# Altium schematic sheet Measure.SchDoc: AC POWER METER
size 420 x 297 mm; DrawnBy: Truong Giang; DocumentNumber: Learning; SheetNumber: 5; SheetTotal: 6
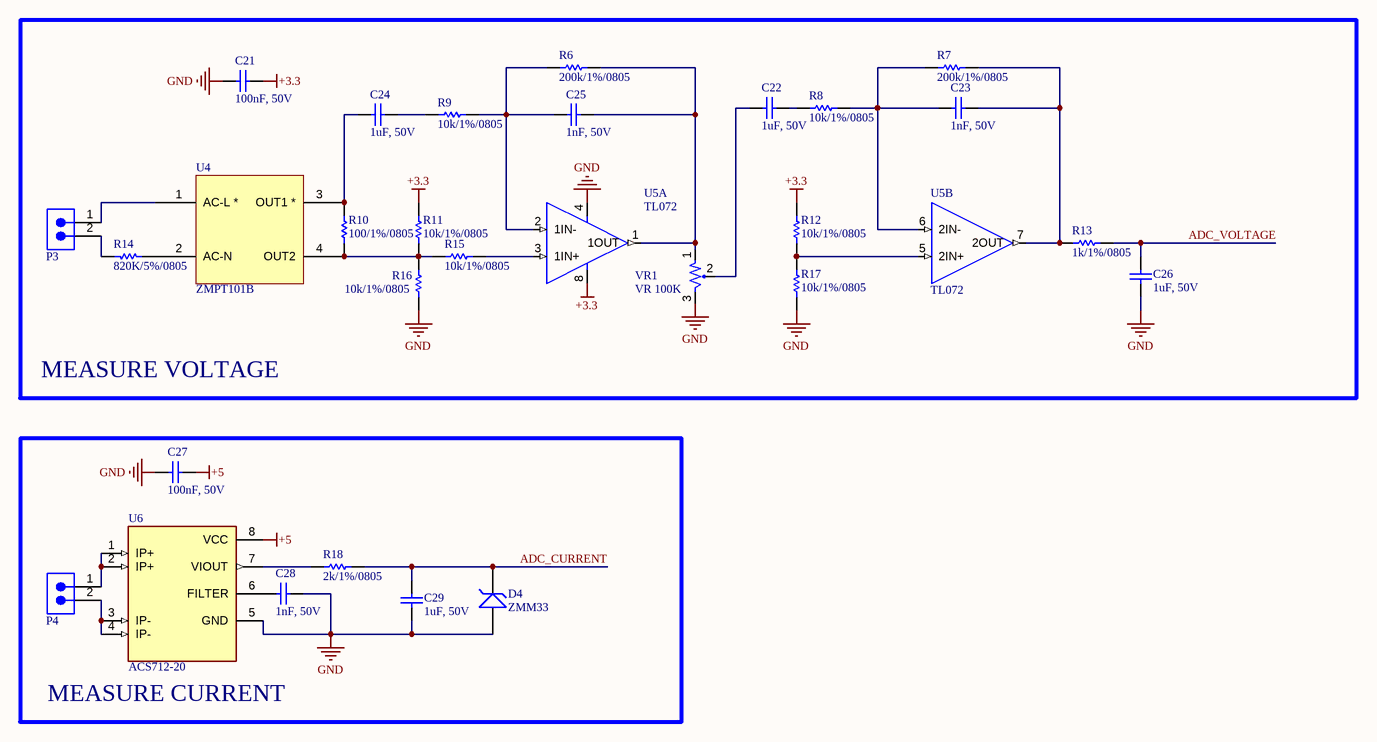
[diagram p0: Measure.SchDoc]

## Parts
C21  100nF, 50V  [WCAP-CSGP_0805_H=0.8mm_Wave]
C22  1uF, 50V  [WCAP-CSGP_0805_H=1.25mm]
C23  1nF, 50V  [WCAP-CSGP_0805_H=0.8mm_Wave]
C24  1uF, 50V  [WCAP-CSGP_0805_H=1.25mm]
C25  1nF, 50V  [WCAP-CSGP_0805_H=0.8mm_Wave]
C26  1uF, 50V  [WCAP-CSGP_0805_H=1.25mm]
C27  100nF, 50V  [WCAP-CSGP_0805_H=0.8mm_Wave]
C28  1nF, 50V  [WCAP-CSGP_0805_H=0.8mm_Wave]
C29  1uF, 50V  [WCAP-CSGP_0805_H=1.25mm]
D4  ZMM33  [SOD-80]
P3  691312710002  [691312710002]  (value not drawn)
P4  691312710002  [691312710002]  (value not drawn)
R6  value 200k/1%/0805  [RES-SM-0805]  (hidden comment: RESISTOR SMD)
R7  value 200k/1%/0805  [RES-SM-0805]  (hidden comment: RESISTOR SMD)
R8  value 10k/1%/0805  [RES-SM-0805]  (hidden comment: RESISTOR SMD)
R9  value 10k/1%/0805  [RES-SM-0805]  (hidden comment: RESISTOR SMD)
R10  value 100/1%/0805  [RES-SM-0805]  (hidden comment: RESISTOR SMD)
R11  value 10k/1%/0805  [RES-SM-0805]  (hidden comment: RESISTOR SMD)
R12  value 10k/1%/0805  [RES-SM-0805]  (hidden comment: RESISTOR SMD)
R13  value 1k/1%/0805  [RES-SM-0805]  (hidden comment: RESISTOR SMD)
R14  value 820K/5%/0805  [RES-SM-0805]  (hidden comment: RESISTOR SMD)
R15  value 10k/1%/0805  [RES-SM-0805]  (hidden comment: RESISTOR SMD)
R16  value 10k/1%/0805  [RES-SM-0805]  (hidden comment: RESISTOR SMD)
R17  value 10k/1%/0805  [RES-SM-0805]  (hidden comment: RESISTOR SMD)
R18  value 2k/1%/0805  [RES-SM-0805]  (hidden comment: RESISTOR SMD)
U4  ZMPT101B  [ZMPT101B]
U5  TL072  [DIP794W45P254L1060H508Q8]  (parts A,B of 2)
U6  ACS712-20  [SOIC127P600X175-8N]
VR1  value VR 100K  [VARISTOR 2]  (hidden comment: 10K)

## Blocks framed on the sheet
MEASURE VOLTAGE: C21-C26 P3 R6-R17 U4 U5 VR1
MEASURE CURRENT: C27-C29 D4 P4 R18 U6

## Nets
+3.3: C21.2 R11.1 R12.1 U5.8(VCC+)
+5: C27.2 U6.8(VCC)
GND: C21.1 C26.1 C27.1 C28.2 C29.1 D4.1(A) R16.1 R17.1 U5.4(VCC-) U6.5(GND) VR1.3
ADC_CURRENT: C29.2 D4.2(K) R18.2
ADC_VOLTAGE: C26.2 R13.2
NetC22_1: C22.1 R8.1
NetC22_2: C22.2 VR1.2
NetC23_1: C23.1 R7.2 R13.1 U5.7(2OUT)
NetC23_2: C23.2 R7.1 R8.2 U5.6(2IN-)
NetC24_1: C24.1 R10.1 U4.3(OUT1_*)
NetC24_2: C24.2 R9.1
NetC25_1: C25.1 R6.1 R9.2 U5.2(1IN-)
NetC25_2: C25.2 R6.2 U5.1(1OUT) VR1.1
NetC28_1: C28.1 U6.6(FILTER)
NetP3_1: P3.1 U4.1(AC-L_*)
NetP3_2: P3.2 R14.2
NetP4_1: P4.1 U6.1(IP+) U6.2(IP+)
NetP4_2: P4.2 U6.3(IP-) U6.4(IP-)
NetR10_2: R10.2 R11.2 R15.1 R16.2 U4.4(OUT2)
NetR12_2: R12.2 R17.2 U5.5(2IN+)
NetR14_1: R14.1 U4.2(AC-N)
NetR15_2: R15.2 U5.3(1IN+)
NetR18_1: R18.1 U6.7(VIOUT)

## Notes on the sheet
- PROJECT
- TITLE
- DRAWN BY
- SIZE
- FILE NAME
- SHEET
- OF
- A3

## Library data of the parts
C21 C27 = 885012207098: WCAP-CSGP Multilayer Ceramic Chip Capacitor, General Purpose, size 0805, X7R, 100nF, 50V; Manufacturer: Wurth Elektronik; Rated Voltage: 50VDC; Isolation Resistance: >=5GOhm; Capacitance Tolerance: +/-10%; Technical Reference: X7R0805104K050DFCT10000; ComponentLink1Description: Manufacturer; ComponentLink1URL: http://www.we-online.de; ComponentLink2Description: Datasheet; ComponentLink2URL: https://www.we-online.com/catalog/datasheet/885012207098.pdf; Operating Temperature: -55 to +125degC; Packaging: Tape and Reel; Manufacturer Part Number: 885012207098; Published Date: May 2020; Ceramic Type: X7R; Dissipation Factor: =<2.5%; Height: 0.8mm; Mounting Technology: SMT; Size: 0805; Capacitance: 100nF
C22 C24 C26 C29 = 885012207103: WCAP-CSGP Multilayer Ceramic Chip Capacitor, General Purpose, size 0805, X7R, 1uF, 50V; Manufacturer: Wurth Elektronik; Rated Voltage: 50VDC; Isolation Resistance: >=0.1GOhm; Capacitance Tolerance: +/-10%; Technical Reference: X7R0805105K050DFCT10000; ComponentLink1Description: Manufacturer; ComponentLink1URL: http://www.we-online.de; ComponentLink2Description: Datasheet; ComponentLink2URL: https://www.we-online.com/catalog/datasheet/885012207103.pdf; Operating Temperature: -55 to +125degC; Packaging: Tape and Reel; Manufacturer Part Number: 885012207103; Published Date: May 2020; Ceramic Type: X7R; Dissipation Factor: =<10%; Height: 1.25mm; Mounting Technology: SMT; Size: 0805; Capacitance: 1uF
C23 C25 C28 = 885012007063: WCAP-CSGP Multilayer Ceramic Chip Capacitor, General Purpose, size 0805, NP0, 1nF, 50V; Manufacturer: Wurth Elektronik; Rated Voltage: 50VDC; Isolation Resistance: >=10GOhm; Capacitance Tolerance: +/-5%; Dissipation Factor: Q>=1000; Technical Reference: NP00805102J050DFCT10000; ComponentLink1Description: Manufacturer; ComponentLink1URL: http://www.we-online.de; ComponentLink2Description: Datasheet; ComponentLink2URL: https://www.we-online.com/catalog/datasheet/885012007063.pdf; Operating Temperature: -55 to +125degC; Packaging: Tape and Reel; Manufacturer Part Number: 885012007063; Published Date: May 2020; Ceramic Type: NP0; Height: 0.8mm; Mounting Technology: SMT; Size: 0805; Capacitance: 1nF
D4 = ZMM33: Diode Zenner
P3 P4 = 691312710002: WR-TBL Series 3127 Open Horizontal PCB Header, THT, pitch 5mm, 2p; Manufacturer: Wurth Elektronik; Modularity: No; Rated Current: 20A; Working Voltage: 300V; ComponentLink1Description: Website Link; ComponentLink1URL: https://www.we-online.com/redexpert/article/691312710002?ad; ComponentLink2Description: Datasheet Link; ComponentLink2URL: https://www.we-online.com/redexpert/spec/691312710002?ad; Manufacturer Part Number: 691312710002; Category: Terminal Blocks; Match Code: WR-TBL; Mount: Through Hole; Operating Temperature Max: 105°C; Operating Temperature Min: -40°C; Packaging: Box; Application: Pluggable; Number of Pins: 2; Number of Rows: 1; Orientation: Horizontal; Pitch: 5mm
R6-R18 = RESISTOR SMD: Resistor
U4 = ZMPT101B: Minuscule 2mA/2mA Precision Voltage Transformer
U5 = TL072: J-FET Amplifier 2 Circuit 8-SO; MF: STMicroelectronics; Package: SOIC-8 STMicroelectronics; Value: *; Price: None; MP: TL072; SnapEDA_Link: https://www.snapeda.com/parts/TL072/STMicroelectronics/view-part/1499677/?ref=snap; Availability: Unavailable
U6 = ACS712-20: ACS712: IC de sensor de corriente lineal basado en efecto Hall totalmente integrado con aislamiento de voltaje de 2,1 kV RMS y un conductor de corriente de baja resistencia; MF: Analog Devices; Value: *; MP: ACS712-20; Price: None; Package: None; Availability: In Stock; SnapEDA_Link: https://www.snapeda.com/parts/ACS712-20/Analog+Devices/view-part/?ref=snap; Check_prices: https://www.snapeda.com/parts/ACS712-20/Analog+Devices/view-part/?ref=eda
VR1 = Var Resistor